# EAGLE design tvbgone3 (EAGLE 7.2.0)
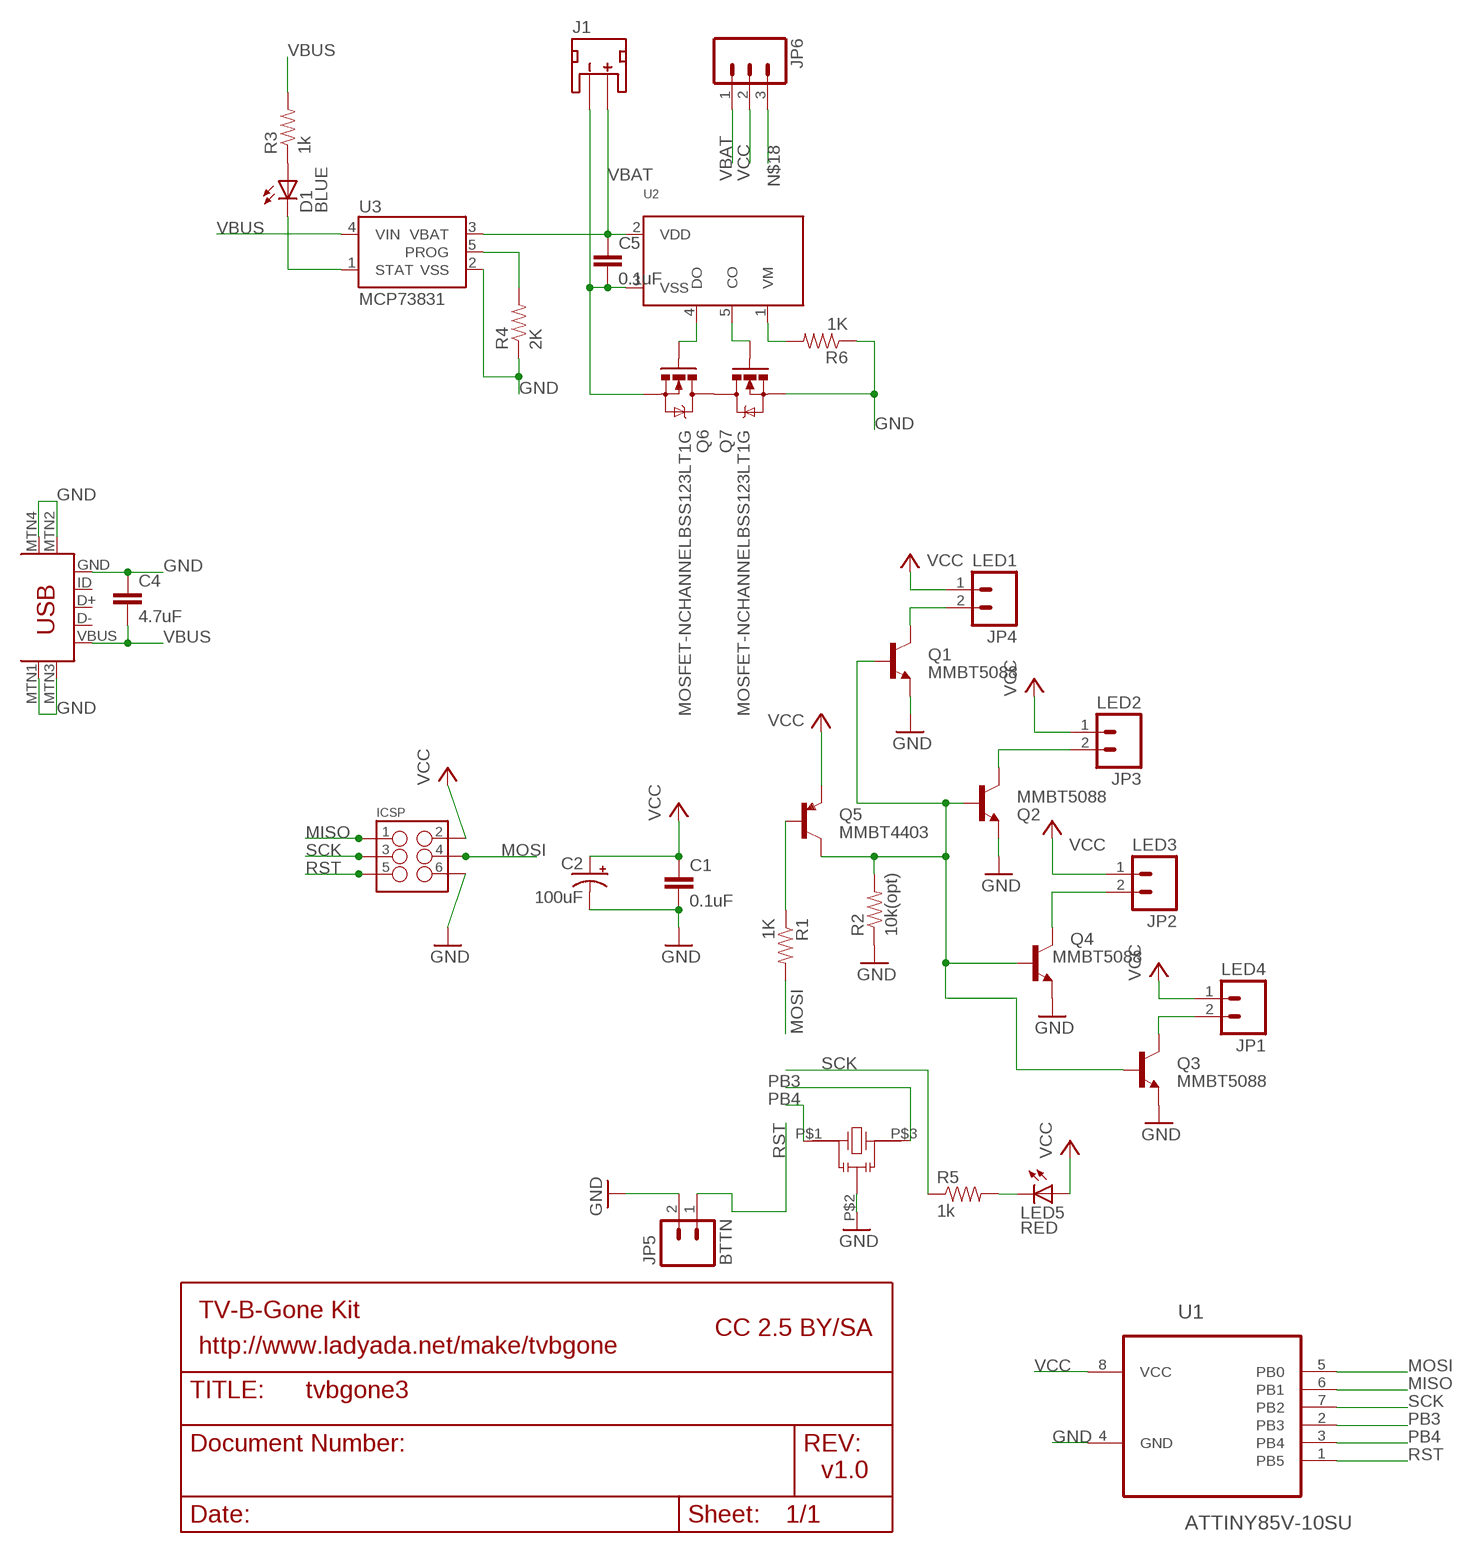
[diagram p0: schematic, sheet 1]

## Parts
C1  0.1uF  0.1UF-25V-5%(0603)  [0603-CAP]
C2  100uF  CAP_POLC  [PANASONIC_C]
C4  4.7uF  0.22UF50V-20%,+80%(0603)  [0603-CAP]
C5  0.1uF  0.22UF50V-20%,+80%(0603)  [0603-CAP]
D1  BLUE  LED-BLUE0603  [LED-0603]
ICSP  M03X2SMT  [2X3_SMT_POSTS]
J1  JST_2MM_MALE  [JST-2-SMD]
JP1  LED4  M02PTH3  [1X02_LONGPADS]
JP2  LED3  M02PTH3  [1X02_LONGPADS]
JP3  LED2  M02PTH3  [1X02_LONGPADS]
JP4  LED1  M02PTH3  [1X02_LONGPADS]
JP5  BTTN  M02PTH3  [1X02_LONGPADS]
JP6  M03SMD_RA_MALE  [1X03_SMD_RA_MALE]
LED5  RED  LED0603  [LED-0603]
Q1  MMBT5088  TRANSISTOR_NPNMMBT5088  [SOT23]
Q2  MMBT5088  TRANSISTOR_NPNMMBT5088  [SOT23]
Q3  MMBT5088  TRANSISTOR_NPNMMBT5088  [SOT23]
Q4  MMBT5088  TRANSISTOR_NPNMMBT5088  [SOT23]
Q5  MMBT4403  TRANSISTOR_PNPMMBT4403  [SOT23]
Q6  MOSFET-NCHANNELBSS123LT1G  [SOT23]
Q7  MOSFET-NCHANNELBSS123LT1G  [SOT23]
R1  1K  2MOHMS-1/10W-1%(0603)  [0603-RES]
R2  10k(opt)  2MOHMS-1/10W-1%(0603)  [0603-RES]
R3  1k  3.3MOHM-1/10W-1%(0603)  [0603-RES]
R4  2K  3.3MOHM-1/10W-1%(0603)  [0603-RES]
R5  1k  2MOHMS-1/10W-1%(0603)  [0603-RES]
R6  1K  3.3MOHM-1/10W-1%(0603)  [0603-RES]
U1  ATTINY85V-10SU  [SOIC127P798X216-8N]
U2  S-8241  [SOT23-5L]
U3  MCP73831  [SOT23-5]
U$1  CTSCE8M_00G52  [CSTCE]
U$2  USB-MINIB-5PIN  [USB-MINIB]

## Nets
GND: C1.2 C2.- C4.1 ICSP.6 JP5.2 Q1.2(E) Q2.2(E) Q3.2(E) Q4.2(E) Q7.2(S) R2.1 R4.1 R6.1 U1.4(GND) U3.2(VSS) U$1.P$2 U$2.GND U$2.MTN1(MTN2) U$2.MTN2(MTN3) U$2.MTN3(MTN1) U$2.MTN4
MISO: ICSP.1 U1.6(PB1)
MOSI: ICSP.4 R1.2 U1.5(PB0)
N$1: JP4.2 Q1.3(C)
N$2: JP3.2 Q2.3(C)
N$3: LED5.C R5.2
N$4: JP1.2 Q3.3(C)
N$5: C5.2 J1.1(-) Q6.2(S) U2.3(VSS)
N$6: Q5.1(B) R1.1
N$7: JP2.2 Q4.3(C)
N$8: D1.C U3.1(STAT)
N$9: D1.A R3.1
N$10: Q1.1(B) Q2.1(B) Q3.1(B) Q4.1(B) Q5.3(C) R2.2
N$11: R4.2 U3.5(PROG)
N$12: Q6.3(D) Q7.3(D)
N$13: Q6.1(G) U2.4(DO)
N$14: Q7.1(G) U2.5(CO)
N$15: R6.2 U2.1(VM)
N$18: JP6.3
PB3: U1.2(PB3) U$1.P$3
PB4: U1.3(PB4) U$1.P$1
RST: ICSP.5 JP5.1 U1.1(PB5)
SCK: ICSP.3 R5.1 U1.7(PB2)
VBAT: C5.1 J1.2(+) JP6.1 U2.2(VDD) U3.3(VBAT)
VBUS: C4.2 R3.2 U3.4(VIN) U$2.VBUS
VCC: C1.1 C2.+ ICSP.2 JP1.1 JP2.1 JP3.1 JP4.1 JP6.2 LED5.A Q5.2(E) U1.8(VCC)
Unconnected: J1.NC1(PAD1) J1.NC2(PAD2) U$2.D+ U$2.D- U$2.ID

## Notes on the sheet
- TV-B-Gone Kit
- CC 2.5 BY/SA
- http://www.ladyada.net/make/tvbgone
- v1.0

## Library data of the parts
C1 = SparkFun-Capacitors:0.1UF-25V-5%(0603): CAP-08604; PROD_ID: CAP-08604
C2 = SparkFun-Capacitors:CAP_POL: Capacitor Polarized These are standard SMD and PTH capacitors. Normally 10uF, 47uF, and 100uF in electrolytic and tantalum varieties. Always verify the external diameter of the through hole cap, it varies with capacity, voltage, and manufacturer. The EIA devices should be standard.
C4 C5 = SparkFun-Capacitors:0.22UF50V-20%,+80%(0603): CAP-09885; PROD_ID: CAP-09885; VALUE: 0.22uF
D1 = SparkFun-LED:LED-BLUE: Blue LEDs for production use Various blue LEDs stocked by SparkFun production 0603 - DIO-08575 Rebel - DIO-09553 1206 - DIO-09911; PROD_ID: DIO-08575
ICSP = SparkFun-Connectors:M03X2: 2x3 .1" header. Shrouded, with keying- CONN-10681 SMT- CONN-11415 Pogo pins- HW-11044; PROD_ID: CONN-11415
J1 = SparkFun-Connectors:JST_2MM_MALE: Mates to single-cell LiPo batteries. CONN-08352; PROD_ID: CONN-08352
JP1-JP5 = SparkFun-Connectors:M02: Standard 2-pin 0.1" header. Use with - straight break away headers ( PRT-00116) - right angle break away headers (PRT-00553) - swiss pins (PRT-00743) - machine pins (PRT-00117) - female headers (PRT-00115) Molex polarized connector foot print use with: PRT-08233 with associated crimp pins and housings. 2.54_SCREWTERM for use with PRT-10571. 3.5mm Screw Terminal footprints for PRT-08084 5mm Screw Terminal footprints for use with PRT-08433
JP6 = SparkFun-Connectors:M03: Header 3 Standard 3-pin 0.1" header. Use with straight break away headers (SKU : PRT-00116), right angle break away headers (PRT-00553), swiss pins (PRT-00743), machine pins (PRT-00117), and female headers (PRT-00115). Molex polarized connector foot print use with SKU : PRT-08232 with associated crimp pins and housings.; PROD_ID: CONN-10925
LED5 = SparkFun-LED:LED: LEDs Standard schematic elements and footprints for 5mm, 3mm, 1206, and 0603 sized LEDs. 5mm - Spark Fun Electronics SKU : COM-00529 (and others)
Q1-Q4 = SparkFun-DiscreteSemi:TRANSISTOR_NPN: Generic NPN BJT MMBT2222A - TRANS-08049 (SOT-23, 1A 40V) MPSA42 - TRANS-09116 (SOT-23, 500mA 300V) MMBT5088LT1G - TRANS-11160 (SOT-23, 50 mA 30V); PROD_ID: TRANS-11160
Q5 = SparkFun-DiscreteSemi:TRANSISTOR_PNP: Generic PNP BJT Double check pinouts against datasheets- not all devices are the same! MMBT3906 - 40V 200mA SOT-23 (TRANS-08052) MMBT4403 - 40V 600mA SOT-23 (TRANS-09245); PROD_ID: TRANS-09245
Q6 Q7 = electric_imp:MOSFET-NCHANNEL: Common NMOSFET Parts MFG P/N Store ID Prod ID FDD8780 TRANS-09984 SI7820DN TRANS-11055 FDS6630A IC-08089 2N7002PW TRANS-11151 FQP30N06L COM-10213 TRANS-10060 BSS123LT1G TRANS-08345 BSS138 TRANS-00830 BS170 2N7000; PROD_ID: TRANS-08345
R1 R2 R5 = SparkFun-Resistors:2MOHMS-1/10W-1%(0603): RES-10054; PROD_ID: RES-10054; VALUE: 2.0M
R3 R4 R6 = SparkFun-Resistors:3.3MOHM-1/10W-1%(0603): RES-11057; PROD_ID: RES-11057
U1 = Atmel_By_element14_Batch_1:ATTINY85V-10SU: 8-bit Microcontroller with In-System Programmable Flash; MPN: ATTINY85V-10SU; OC_FARNELL: 1455166; OC_NEWARK: 58M3799; PACKAGE: SOIC-8; SUPPLIER: Atmel
U2 = electric_imp:S-8241: Seiko S-8241
U3 = electric_imp:MCP73831: Miniature single cell, fully integrated Li-Ion, Li-polymer charge management controller http://ww1.microchip.com/downloads/en/DeviceDoc/21984a.pdf IC-09995; PROD_ID: IC-09995
U$1 = murata_electronics:CTSCE8M_00G52
U$2 = SparkFun-Connectors:USB-MINIB: Mini-USB "B" connector with 5th pin broken out. Created new symbol breaking out 5th "ID" pin in mini/micro USB connector spec. See: http://en.wikipedia.org/wiki/Mini_usb#Cables. Uses same footprint as 4-pin symbol. Also added pins to connect to mounting / shield pads if required (probably not generally needed as signals aren't shielded once they leave the connector).

## Board
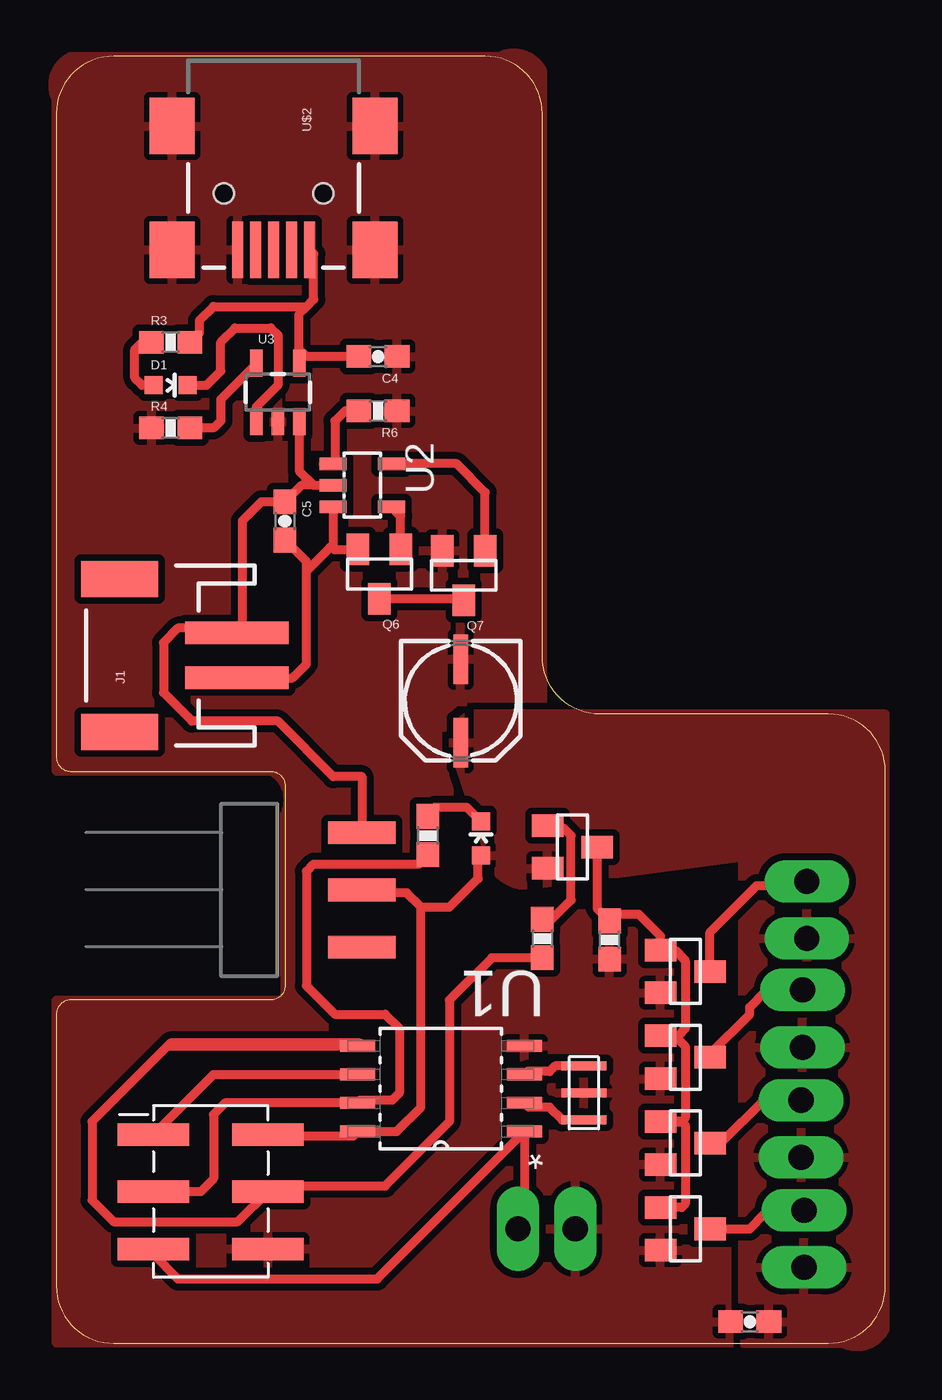
[diagram p1: board, top side]

Size 36.83 x 57.15 mm. Coordinates in mm from the lower left corner, seen from the top.
Outline: 2.54,0 34.29,0 arc90 36.83,2.54 36.83,25.4 arc90 34.29,27.94 24.13,27.94 arc-90 21.59,30.48 21.59,54.61 arc90 19.05,57.15 2.54,57.15 arc90 0,54.61 0,26.04 arc90 0.64,25.4 9.53,25.4 arc-90 10.16,24.77 10.16,15.88 arc-90 9.53,15.24 0.64,15.24 arc90 0,14.61 0,2.54 arc90 2.54,0
Copper layers (1*16): Top 0.035mm / dielectric 1.5mm / Bottom 0.035mm
Design rules "default": minimum track width 10mil, minimum drill 20mil, track to track 12mil, track to pad 12mil, pad to pad 12mil, via to via 12mil, smd to smd 0mil, copper to edge 0mil, drill to drill 8mil, minimum pad ring 10mil, minimum via ring 8mil, stop-mask expansion 4mil, vias tented up to drill 0mil, thermal gap 10mil

### Footprints (pad centres in the part's own frame; a part is rotated, then mirrored left to right if it is on the bottom)
0603-CAP = smd 1.1 x 1: 1 -0.85,0; 2 0.85,0
PANASONIC_C = smd 2.2 x 0.65: + 1.9,-0.2; - -1.8,-0.2
LED-0603 = smd 0.8 x 0.8: A 0,-0.75; C 0,0.75
2X3_SMT_POSTS = smd 1 x 3.17: 1 -2.54,-2.54; 2 -2.54,2.54; 3 0,-2.54; 4 0,2.54; 5 2.54,-2.54; 6 2.54,2.54
JST-2-SMD = smd 1 x 4.6: 1 -1,-3.7; 2 1,-3.7 | smd 1.6 x 3.4: NC1 -3.4,1.5; NC2 3.4,1.5
1X02_LONGPADS = drill 1.118 pad 1.88 long: 1 0,0; 2 2.54,0
1X03_SMD_RA_MALE = smd 1 x 3: 1 -2.54,5; 2 0,5; 3 2.54,5
SOT23 = smd 1 x 1.4: 1 -0.95,-1.1; 2 0.95,-1.1; 3 0,1.1
0603-RES = smd 1.1 x 1: 1 -0.85,0; 2 0.85,0
SOIC127P798X216-8N = smd 1.549 x 0.533: 1 -3.708,1.905; 2 -3.708,0.635; 3 -3.708,-0.635; 4 -3.708,-1.905; 5 3.708,-1.905; 6 3.708,-0.635; 7 3.708,0.635; 8 3.708,1.905
SOT23-5L = smd 0.55 x 1.2: 1 -0.95,-1.3; 2 0,-1.3; 3 0.95,-1.3; 4 0.95,1.3; 5 -0.95,1.3
SOT23-5 = smd 0.55 x 1.2: 1 -0.95,-1.3; 2 0,-1.3; 3 0.95,-1.3; 4 0.95,1.3; 5 -0.95,1.3
CSTCE = smd 0.4 x 2: P$1 -1.2,0; P$2 0,0; P$3 1.2,0
USB-MINIB = smd 2.5 x 0.5: D+ 2.5,0; D- 2.5,0.8; GND 2.5,-1.6; ID 2.5,-0.8; VBUS 2.5,1.6 | smd 2.5 x 2: MTN1 -3,4.5; MTN2 2.5,4.5; MTN3 -3,-4.5; MTN4 2.5,-4.5 | hole 0.9: 0,2.2; 0,-2.2

### Placement (x,y rotation side)
C1  30.8,0.95 180 top
C2  18.16,28.57 270 top
C4  14.29,43.81 180 top
C5  10.16,36.51 270 top
D1  5.08,42.55 270 top
ICSP  6.86,6.73 270 top
J1  4.32,30.54 90 top
JP1  33.08,8.26 90 top
JP2  33.21,3.37 90 top
JP3  33.15,13.14 90 top
JP4  33.34,17.97 90 top
JP5  20.51,5.08 0 top
JP6  8.57,20.13 270 top
LED5  18.86,22.42 0 top
Q1  27.94,16.51 270 top
Q2  27.94,12.7 270 top
Q3  27.94,8.89 270 top
Q4  27.94,5.08 270 top
Q5  22.92,22.03 270 top
Q6  14.35,34.16 180 top
Q7  18.1,34.1 180 top
R1  21.59,17.97 270 top
R2  24.57,17.91 90 top
R3  5.08,44.45 0 top
R4  5.08,40.64 0 top
R5  16.51,22.54 90 top
R6  14.29,41.4 180 top
U1  17.08,11.3 180 top
U2  13.59,38.1 270 top
U3  9.84,42.23 0 top
U$1  23.43,11.11 270 top
U$2  9.65,51.05 270 top

### Tracks (layer width: path | path; a pad name or v marks a point on that pad's centre or on a via)
GND
  pour Top (rank 2): 0,0 0,15.24 10.16,15.24 10.16,23.5 arc90 9.53,25.4 0,25.4 0,55.24 arc-90 0.64,57.15 19.68,57.15 arc-90 21.59,56.52 21.59,27.94 34.92,27.94 35.56,0.64 arc-90 33.66,0
MISO
  Top 0.406: ICSP.1 6.99,11.94 U1.6
MOSI
  Top 0.406: 9.21,6.54 ICSP.4 | 4.95,13.21 1.59,9.84 1.59,6.35 2.54,5.4 8.06,5.4 ICSP.4 | 4.95,13.21 U1.5 13.5,13.34 5.08,13.34 4.95,13.21 | ICSP.4 9.65,6.99 14.61,6.99 17.46,9.84 17.46,15.24 19.34,17.12 R1.2
N$1
  Top 0.406: Q1.3 29.04,18.25 31.11,20.32 33.15,20.32 JP4.2
N$2
  Top 0.406: Q2.3 29.04,12.85 30.8,14.61 30.8,14.92 31.43,15.56 33.02,15.56 JP3.2
N$3
  Top 0.406: R5.2 16.51,23.5 16.83,23.81 18.21,23.81 LED5.C
N$4
  Top 0.406: Q3.3 29.53,8.89 31.43,10.79 JP1.2
N$5
  Top 0.406: 12.29,35.34 U2.3 12.29,35.46 12.16,35.34 | 12.29,35.34 12.38,35.24 13.38,35.24 Q6.2 | J1.1 10.49,29.54 11.11,30.16 11.11,34.29 | 11.11,34.29 12.16,35.34 | 12.16,35.34 12.29,35.34 | 11.11,34.29 11.11,34.71 C5.2
N$6
  Top 0.406: R1.1 22,18.82 22.86,19.68 22.86,22.54 22.54,22.86 21.95,22.86 Q5.1
N$7
  Top 0.406: Q4.3 30.8,5.08 31.43,5.71 33.02,5.71 JP2.2
N$8
  Top 0.406: D1.C 6.67,42.55 7.3,43.18 7.3,44.45 7.94,45.09 9.53,45.09 9.84,44.77 9.84,42.55 8.89,41.59 U3.1
N$9
  Top 0.406: D1.A 3.81,42.55 3.49,42.86 3.49,44.13 3.81,44.45 R3.1
N$10
  Top 0.406: Q5.3 24.02,19.31 R2.2 24.87,19.05 25.88,19.05 26.84,18.09 Q1.1 27.47,17.46 27.94,16.99 27.94,13.97 27.62,13.65 Q2.1 27.47,13.65 27.94,13.18 27.94,10 27.78,9.84 Q3.1 27.78,9.84 27.94,9.68 27.94,6.19 27.78,6.03 Q4.1
N$11
  Top 0.406: U3.5 8.89,43.5 7.3,41.91 7.3,40.96 6.99,40.64 R4.2
N$12
  Top 0.406: Q6.3 18.03,33.06 Q7.3
N$13
  Top 0.406: Q6.1 15.3,36.74 U2.4
N$14
  Top 0.406: Q7.1 19.05,37.78 17.78,39.05 U2.5
N$15
  Top 0.406: 11.87,39.05 U2.1 12.38,39.14 12.38,40.96 12.83,41.4 R6.2
PB3
  Top 0.406: U$1.P$3 22.47,9.91 21.91,10.48 20.98,10.48 U1.2
PB4
  Top 0.406: U$1.P$1 22.16,12.31 21.91,12.06 20.92,12.06 U1.3
RST
  Top 0.406: ICSP.5 4.32,3.94 5.4,2.86 14.25,2.86 U1.1 20.79,5.36 JP5.1
SCK
  Top 0.406: 4.38,6.67 ICSP.3 6.41,6.73 6.99,7.3 6.99,10.16 7.49,10.67 U1.7 13.5,10.79 14.92,10.79 15.24,11.11 15.24,13.97 14.61,14.61 12.38,14.61 11.11,15.88 11.11,20.95 11.43,21.27 16.09,21.27 R5.1
VBAT
  Top 0.406: U3.3 10.79,38.73 11.43,38.1 | JP6.1 13.57,25.16 12.3,25.16 9.84,27.62 6.03,27.62 4.76,28.89 4.76,31.11 5.4,31.75 7.81,31.75 J1.2 8.26,31.78 8.26,36.51 9.11,37.36 C5.1 10.9,38.1 11.43,38.1 | 11.43,38.1 U2.2
VBUS
  Top 0.406: U3.4 10.79,44.13 | 10.79,44.13 10.79,45.72 11.11,46.04 | 11.11,46.04 6.99,46.04 6.35,45.4 6.35,44.87 R3.2 | 11.11,46.04 11.43,46.35 11.43,48.38 U$2.VBUS | C4.2 11.11,43.81 10.79,44.13
VCC
  Top 0.406: ICSP.2 9.46,9.21 13.18,9.21 U1.8 15.11,9.4 16.19,10.48 16.19,19.37 | 16.19,19.37 15.56,20 13.7,20 JP6.2 | 16.19,19.37 17.46,19.37 18.73,20.64 18.73,21.54 LED5.A
  pour Top: 30.48,0 34.92,0 arc90 36.83,0.64 36.83,27.94 18.41,27.94 arc90 17.78,26.04 19.05,22.23 arc90 20.95,20.32 30.48,21.59